# Altium schematic sheet Slave3.SchDoc
size A4; SheetNumber: 6; SheetTotal: 7
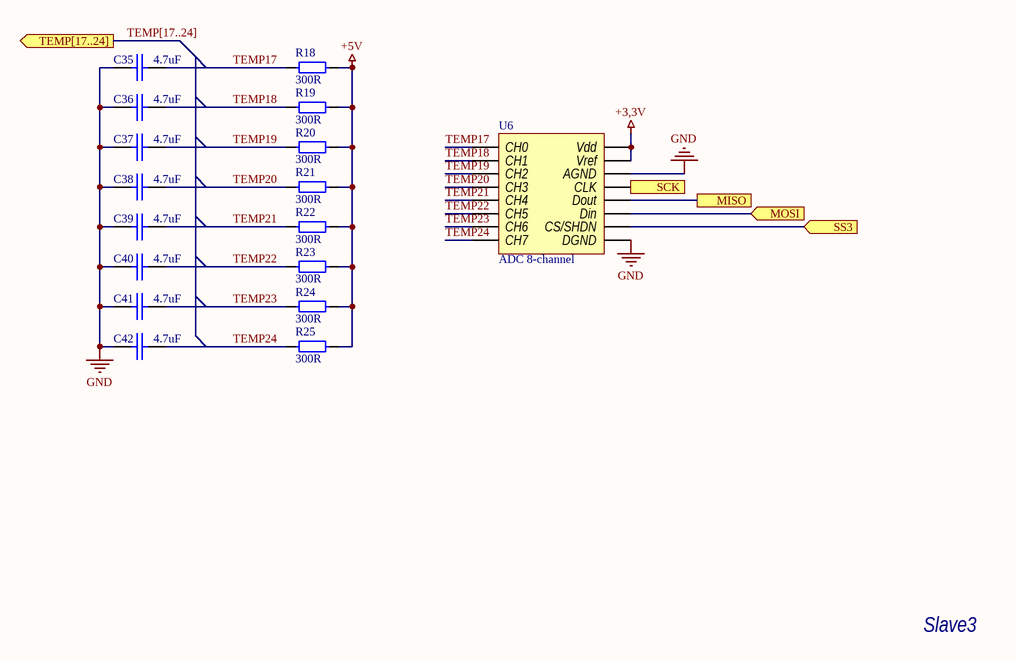
[diagram p0: Slave3.SchDoc]

## Parts
C35  4.7uF  [0603 Capicator]
C36  4.7uF  [0603 Capicator]
C37  4.7uF  [0603 Capicator]
C38  4.7uF  [0603 Capicator]
C39  4.7uF  [0603 Capicator]
C40  4.7uF  [0603 Capicator]
C41  4.7uF  [0603 Capicator]
C42  4.7uF  [0603 Capicator]
R18  300R  [0603 Resistor]
R19  300R  [0603 Resistor]
R20  300R  [0603 Resistor]
R21  300R  [0603 Resistor]
R22  300R  [0603 Resistor]
R23  300R  [0603 Resistor]
R24  300R  [0603 Resistor]
R25  300R  [0603 Resistor]
U6  ADC 8-channel  [SOIC-16]

## Ports
MISO, MOSI (in), SCK, SS3 (in), TEMP[17..24] (out)

## Nets
+3,3V: U6.15(Vref) U6.16(Vdd)
+5V: R18.2 R19.2 R20.2 R21.2 R22.2 R23.2 R24.2 R25.2
GND: C35.1 C36.1 C37.1 C38.1 C39.1 C40.1 C41.1 C42.1 U6.9(DGND) U6.14(AGND)
MISO: U6.12(Dout) ; port MISO
MOSI: U6.11(Din) ; port MOSI
SCK: U6.13(CLK) ; port SCK
SS3: U6.10(CS/SHDN) ; port SS3
TEMP17: C35.2 R18.1 U6.1(CH0)
TEMP18: C36.2 R19.1 U6.2(CH1)
TEMP19: C37.2 R20.1 U6.3(CH2)
TEMP20: C38.2 R21.1 U6.4(CH3)
TEMP21: C39.2 R22.1 U6.5(CH4)
TEMP22: C40.2 R23.1 U6.6(CH5)
TEMP23: C41.2 R24.1 U6.7(CH6)
TEMP24: C42.2 R25.1 U6.8(CH7)

## Buses and harness runs
bus TEMP[17..24] = port TEMP[17..24]

## Notes on the sheet
- Slave3

## Library data of the parts
C35-C42 = Cap 4.7uF (0603): 4.7uF X5R 25V 10% 0603; Manufacturer: Murata Manufacturing; Part Number: GRM188R61E475KE11D; Type: Capacitor; ComponentLink1Description: Chip&Dip; ComponentLink1URL: https://www.chipdip.ru/product0/9000348448
R18-R25 = Res 300R (0603): 0.1W 0603 300R, 1%; Part Number: RC0603FR-07360RL; Manufacturer: Taiwan; Type: Resistor; ComponentLink1Description: Chip&Dip; ComponentLink1URL: https://www.chipdip.ru/product0/9000079629
U6 = MCP3008-I/SL: A/D converter with SPI serial interface; Manufacturer: Microchip; Part Number: MCP3008-I/SL; Type: IC; ComponentLink1Description: ChipDip; ComponentLink1URL: https://www.chipdip.ru/product/mcp3008-i-sl; ComponentLink2Description: Datadheet; ComponentLink2URL: https://static.chipdip.ru/lib/527/DOC011527685.pdf